# Altium schematic sheet Storage.SchDoc
size A; SheetNumber: 5; SheetTotal: 6
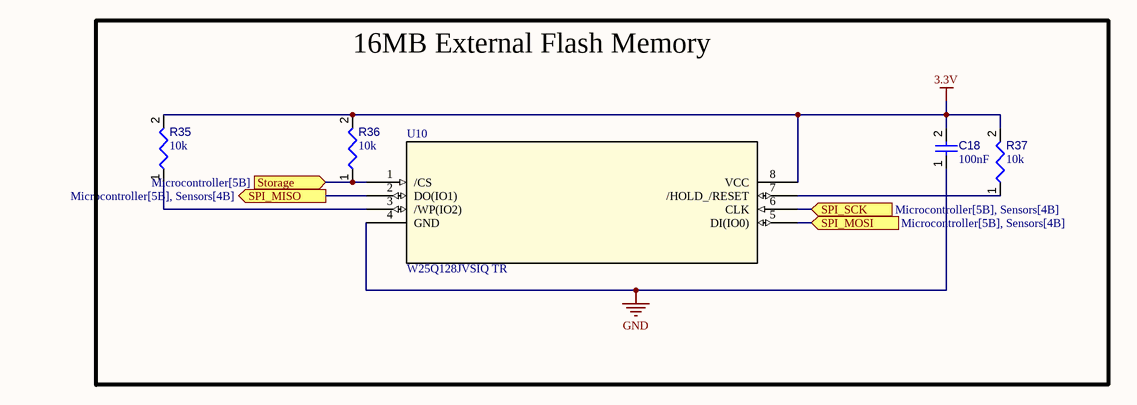
[diagram p0: Storage.SchDoc]

## Parts
C18  value 100nF  [FP-GCJ188-0_2-IPC_C]  (hidden comment: GCJ188R71C104KA01D)
R35  value 10k  [RESC2013X50X35ML15T15]  (hidden comment: Resistor 10k +/-1% 0805 125 mW)
R36  value 10k  [RESC2013X50X35ML15T15]  (hidden comment: Resistor 10k +/-1% 0805 125 mW)
R37  value 10k  [RESC2013X50X35ML15T15]  (hidden comment: Resistor 10k +/-1% 0805 125 mW)
U10  W25Q128JVSIQ TR  [SOIC_208MIL_WIN]

## Blocks framed on the sheet
16MB External Flash Memory: C18 R35-R37 U10

## Ports
SPI_MISO (out, see Microcontroller[5B], Sensors[4B]), SPI_MOSI (in, see Microcontroller[5B], Sensors[4B]), SPI_SCK (in, see Microcontroller[5B], Sensors[4B]), Storage (in, see Microcontroller[5B])

## Nets
3.3V: C18.2 R35.2 R36.2 R37.2 U10.8(VCC)
GND: C18.1 U10.4(GND)
SPI_MISO: U10.2(DO(IO1)) ; port SPI_MISO
SPI_MOSI: U10.5(DI(IO0)) ; port SPI_MOSI
SPI_SCK: U10.6(CLK) ; port SPI_SCK
Storage: R36.1 U10.1(/CS) ; port Storage
NetR35_1: R35.1 U10.3(/WP(IO2))
NetR37_1: R37.1 U10.7(/HOLD_/RESET)

## Library data of the parts
C18 = CMP-001-00083-1: 16V 100nF X7R ±10% 0603 Multilayer Ceramic Capacitors MLCC - SMD/SMT ROHS; Max Operating Temperature: 125°C; Mounting Technology: Surface Mount; Tolerance: 10%; Min Operating Temperature: -55°C; Case/Package: 0603; Voltage Rating: 16V
R35-R37 = CMP-009-00018-5: Chip Resistor, 10 KOhm, +/- 1%, 125 mW, -55 to 155 degC, 0805 (2012 Metric); Power: 125mW; Voltage Rating: 150V; Tolerance: 1%; Pins: 2; Min Operating Temperature: -55°C; Case/Package: 0805; Max Operating Temperature: 155°C; RoHS Compliant: True; Mounting Technology: SM
U10 = W25Q128JVSIQ TR: Description; Manufacturer_Name: Winbond; Copyright: Copyright (C) 2025 Ultra Librarian. All rights reserved.; Manufacturer_Part_Number: W25Q128JVSIQ TR; RefDes: RefDes; Type: Type; Manufacturer Part Number 1: W25Q128JVSIQ TR